# EasyEDA schematic sammy-schematic.json
TITLE: Sheet_1; REV: 1.0; Date: 2026-08-28; Sheet: 1/1; Drawn By: pugotuppcb; Company: Your Company
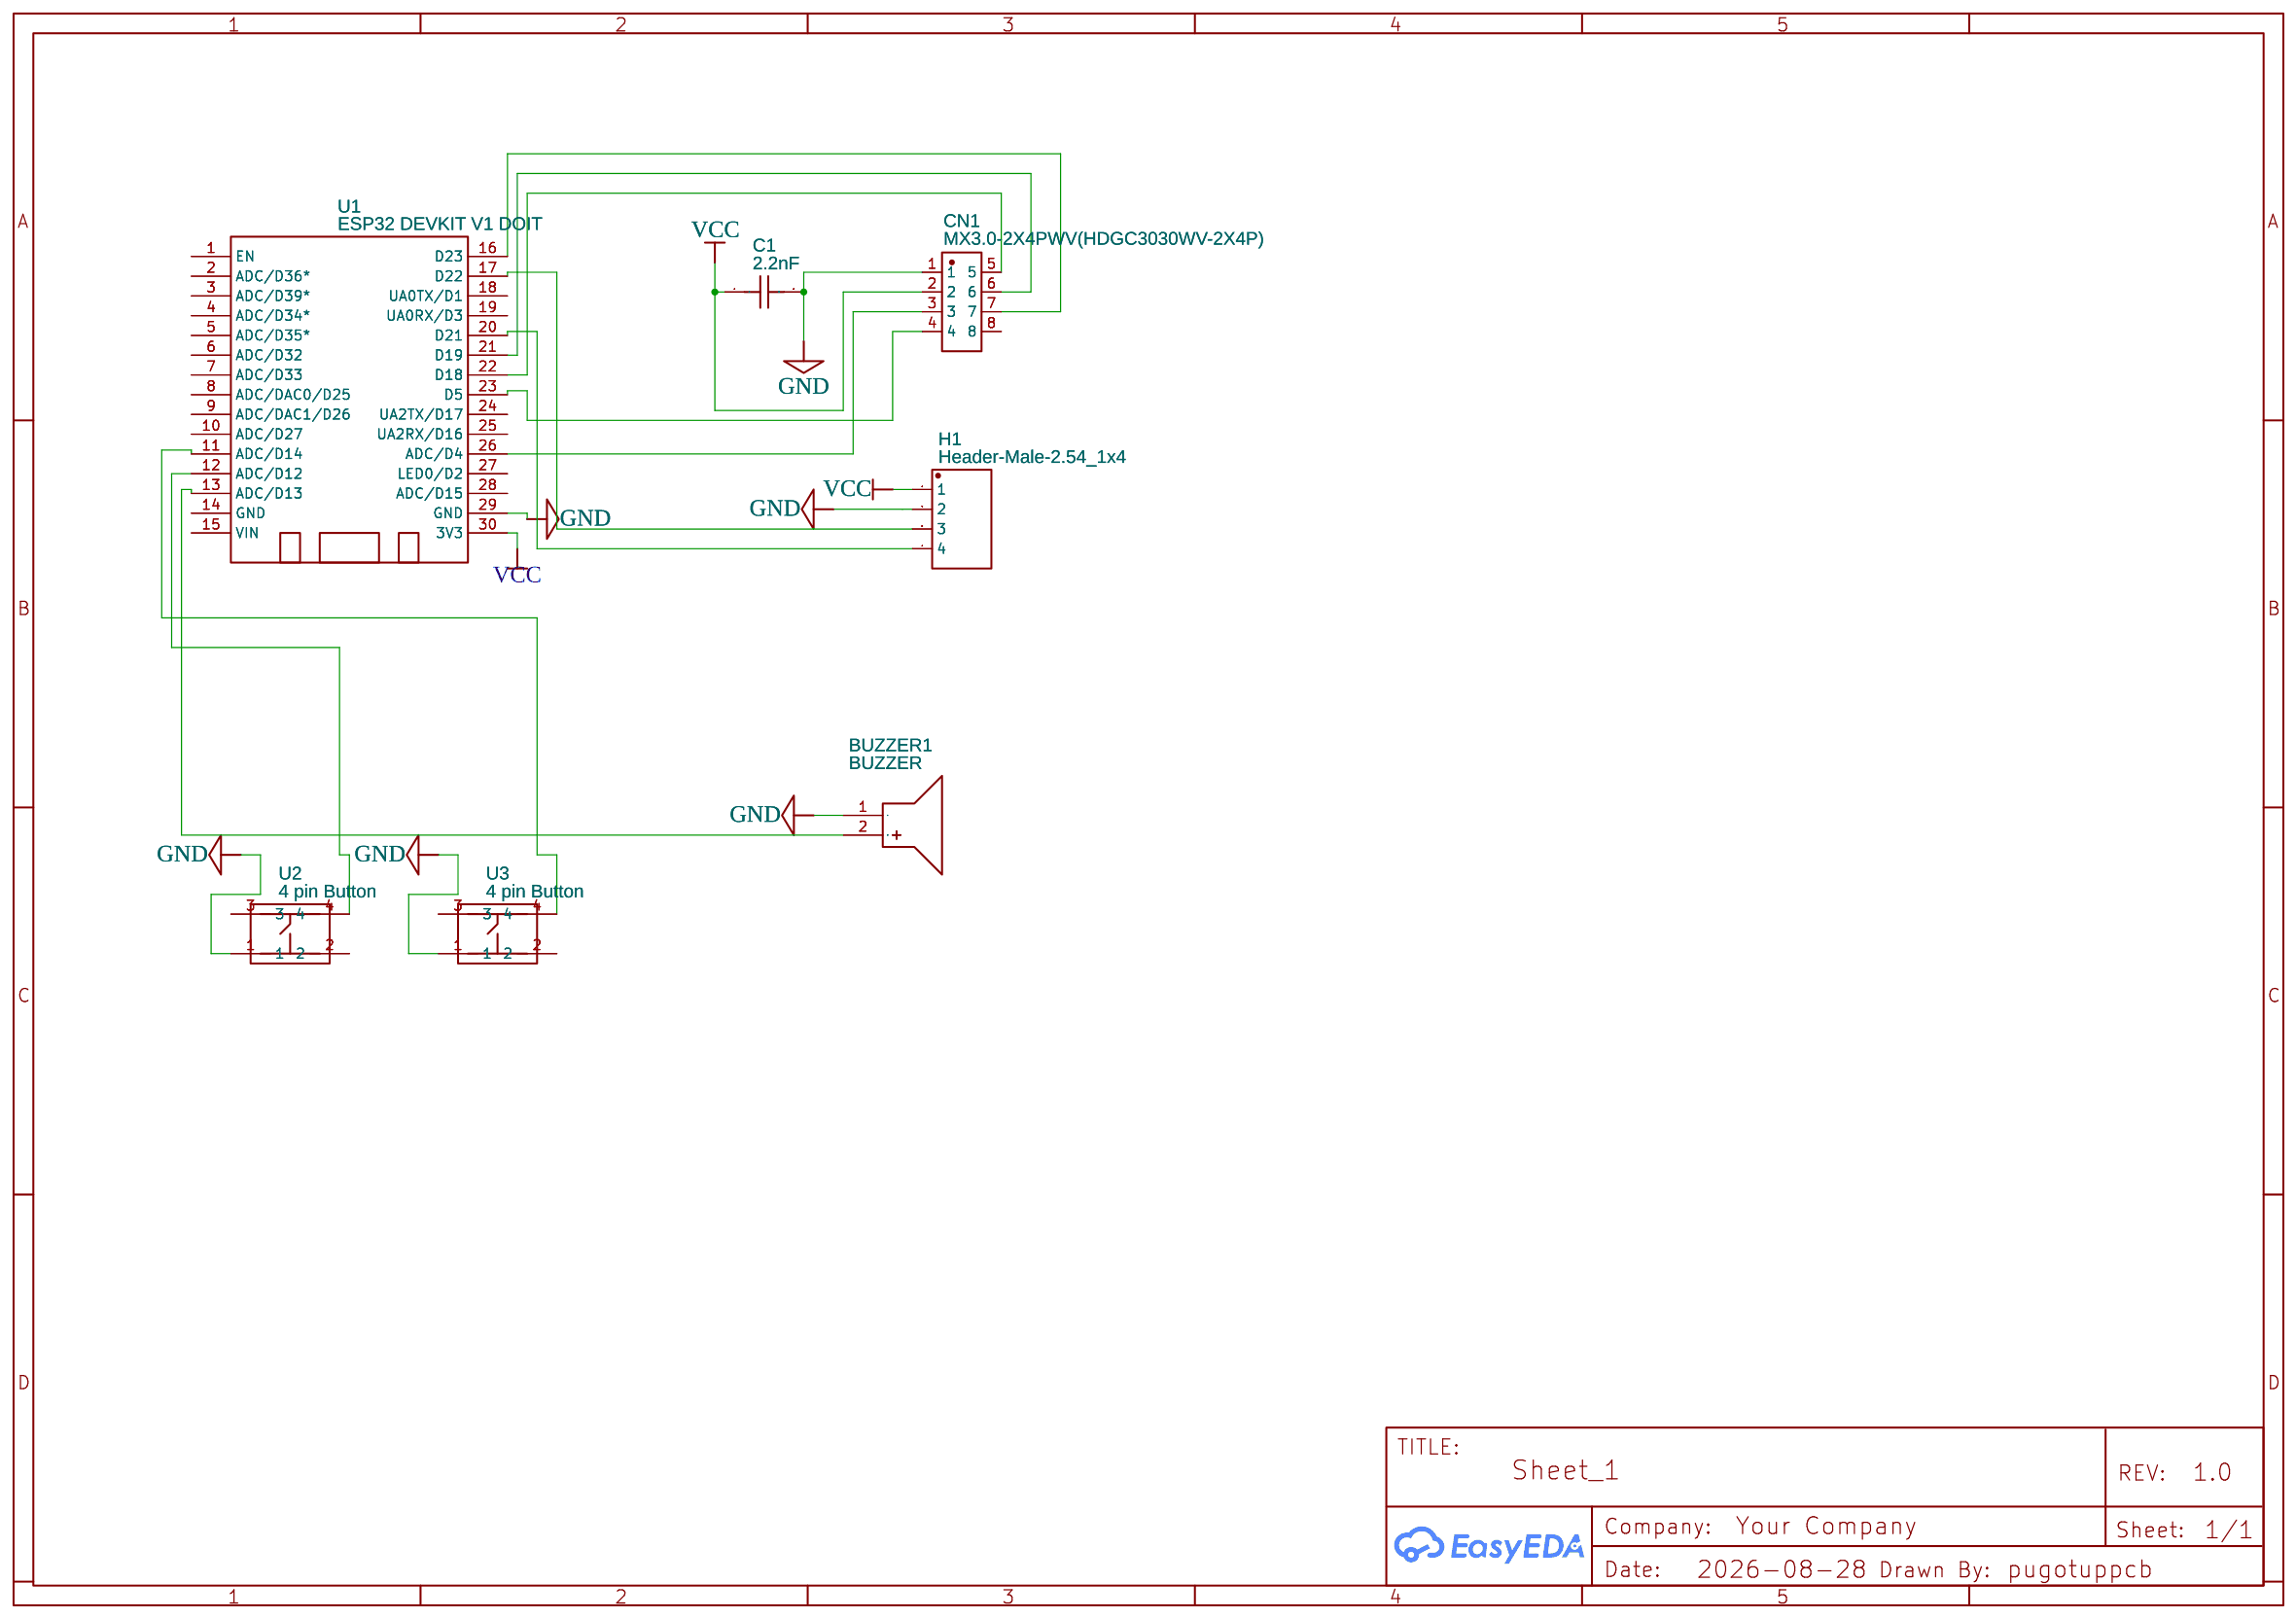
[diagram p0: schematic sheet]

## Parts
BUZZER1  BUZZER  [BUZ-TH_BD12.0-P6.00-D0.9-RD]
C1  2.2nF  [CAP-TH_L5.0-W2.5-P2.50-D0.5]
CN1  MX3.0-2X4PWV(HDGC3030WV-2X4P)  [CONN-SMD_MX3.0-2X4PWV-HDGC3030WV-2X4P]
H1  Header-Male-2.54_1x4  [HDR-TH_4P-P2.54-V-M]
U1  ESP32 DEVKIT V1 DOIT  [DOIT-ESP32-DEVKIT-V1]
U2  4 pin Button  [4 PIN TACTILE BUTTON]
U3  4 pin Button  [4 PIN TACTILE BUTTON]

## Library data of the parts
BUZZER1 = BUZZER: Contributor: lcsc; Supplier: LCSC; Supplier Part: C9900014030; Manufacturer: null; Manufacturer Part: buzzer; JLCPCB Part Class: Extended Part
C1 = C320C222F1G5TA: Supplier: LCSC; Supplier Part: C3697614; Manufacturer: KEMET(基美); JLCPCB Part Class: Extended Part; Contributor: lcsc
CN1 = MX3.0-2X4PWV(HDGC3030WV-2X4P): Supplier: LCSC; Supplier Part: C54557104; Manufacturer: HDGC(华德共创); Contributor: lcsc; JLCPCB Part Class: Extended Part
H1 = Header-Male-2.54_1x4: Contributor: LCSC; Supplier: LCSC; Manufacturer: Ckmtw(灿科盟); Manufacturer Part: B-2100S04P-A110; Supplier Part: C124378; JLCPCB Part Class: Extended Part
U1 = ESP32 DEVKIT V1 DOIT: Contributor: ConceitoTeam
U2 U3 = 4 pin Button: Contributor: Krishanu Biswas

## Nets
GND: BUZZER1.1(-) C1.2 CN1.1 H1.2 U1.29(GND) U2.1 U3.1
VCC: C1.1 CN1.2 H1.1 U1.30(3V3)
Net-(BUZZER1-2): BUZZER1.2(+) U1.13(ADC/D13)
Net-(CN1-3): CN1.3 U1.26(ADC/D4)
Net-(CN1-4): CN1.4 U1.23(D5)
Net-(CN1-5): CN1.5 U1.22(D18)
Net-(CN1-6): CN1.6 U1.21(D19)
Net-(CN1-7): CN1.7 U1.16(D23)
Net-(H1-3): H1.3 U1.17(D22)
Net-(H1-4): H1.4 U1.20(D21)
Net-(U1-11): U1.11(ADC/D14) U3.4
Net-(U1-12): U1.12(ADC/D12) U2.4

Not connected (* = marked no-connect by the designer): CN1 8; U1 1(EN) 2(ADC/D36*) 3(ADC/D39*) 4(ADC/D34*) 5(ADC/D35*) 6(ADC/D32) 7(ADC/D33) 8(ADC/DAC0/D25) 9(ADC/DAC1/D26) 10(ADC/D27) 14(GND) 15(VIN) 18(UA0TX/D1) 19(UA0RX/D3) 24(UA2TX/D17) 25(UA2RX/D16) 27(LED0/D2) 28(ADC/D15); U2 2 3; U3 2 3
